# EAGLE design LDAQ-MOD-ENC4 (EAGLE 6.6.0)
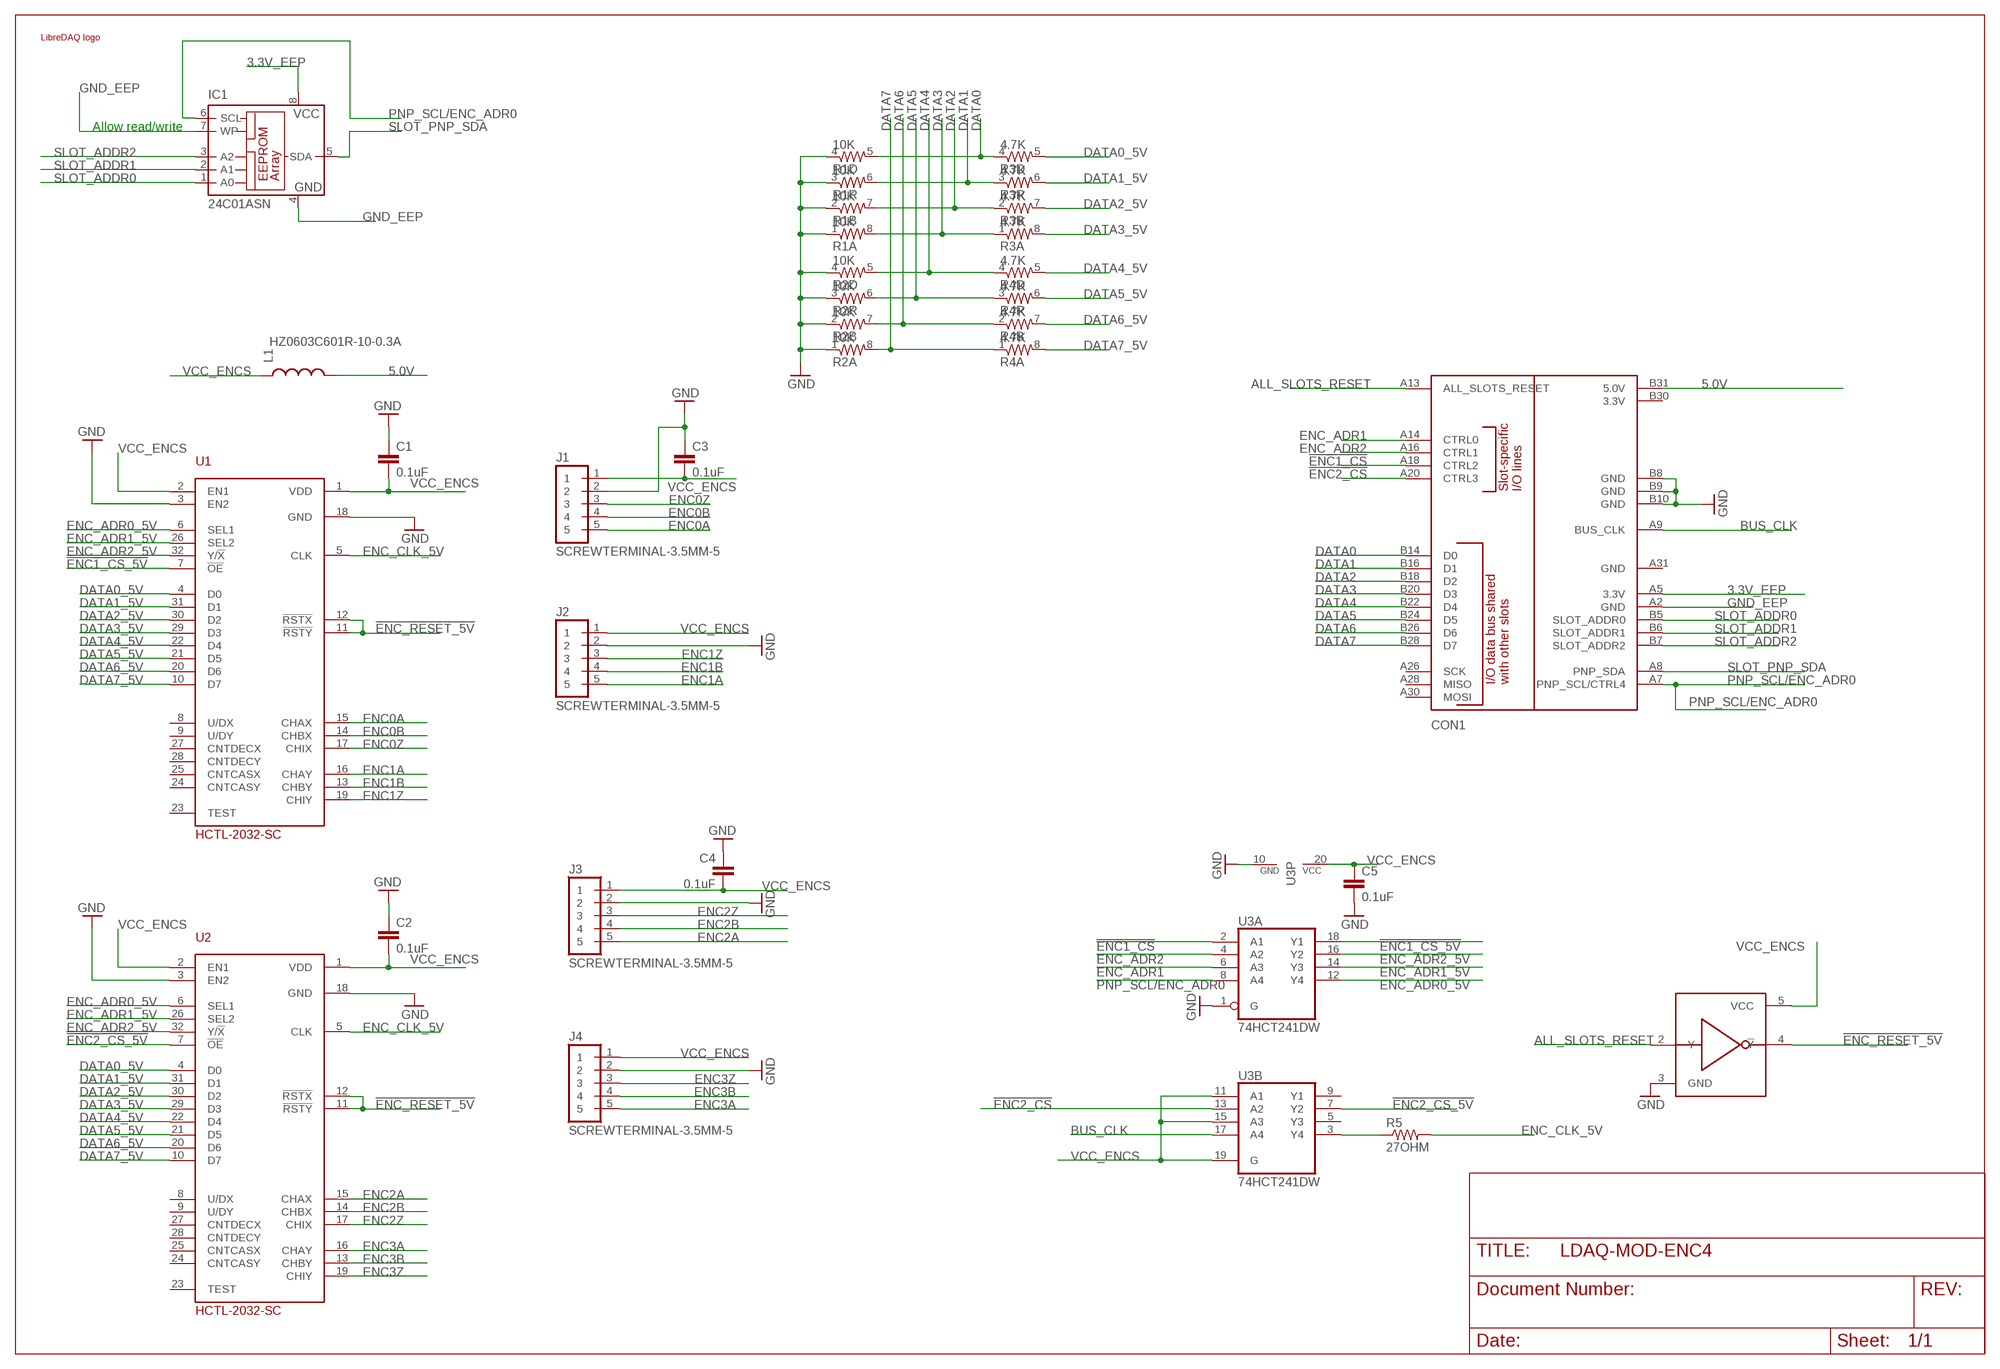
[diagram p0: schematic, sheet 1]

## Parts
C1  0.1uF  0.1UF-25V(+80/-20%)(0603)  [0603-CAP]
C2  0.1uF  0.1UF-25V(+80/-20%)(0603)  [0603-CAP]
C3  0.1uF  0.1UF-25V(+80/-20%)(0603)  [0603-CAP]
C4  0.1uF  0.1UF-25V(+80/-20%)(0603)  [0603-CAP]
C5  0.1uF  0.1UF-25V(+80/-20%)(0603)  [0603-CAP]
CON1  BOARD  LIBREDAQ_DAUGHTER_BOARDPCI-64-SIZE1-PADS  [PCI-E_64_EDGE_70X60_PADS-ONLY]
IC1  24C01ASN  [SO-08]
J1  SCREWTERMINAL-3.5MM-5  [SCREWTERMINAL-3.5MM-5]
J2  SCREWTERMINAL-3.5MM-5  [SCREWTERMINAL-3.5MM-5]
J3  SCREWTERMINAL-3.5MM-5  [SCREWTERMINAL-3.5MM-5]
J4  SCREWTERMINAL-3.5MM-5  [SCREWTERMINAL-3.5MM-5]
L1  HZ0603C601R-10-0.3A  INDUCTOR0603  [0603]
LOGO1  LIBREDAQ_LOGO_MINILOGO_GENERIC  [LIBREDAQ_LOGO]
R1  10K  RESISTOR-ARRAY0603-ARV  [0603-ARV]
R2  10K  RESISTOR-ARRAY0603-ARV  [0603-ARV]
R3  4.7K  RESISTOR-ARRAY0603-ARV  [0603-ARV]
R4  4.7K  RESISTOR-ARRAY0603-ARV  [0603-ARV]
R5  27OHM  33OHM1/10W1%(0603)  [0603]
U1  HCTL-2032-SC  [SOIC32]
U2  HCTL-2032-SC  [SOIC32]
U3  74HCT241DW  [SO20W]
U4  74AHCT1G04  [SOT353-SC70-5]

## Nets
3.3V_EEP: CON1.A5(3.3V) IC1.8(VCC)
5.0V: CON1.B31(5.0V) L1.2
!ENC1_CS: CON1.A18(CTRL2) U3.2(A:A1)
!ENC1_CS_5V: U1.7(!OE) U3.18(A:Y1)
!ENC2_CS: CON1.A20(CTRL3) U3.13(B:A2)
!ENC2_CS_5V: U2.7(!OE) U3.7(B:Y2)
!ENC_RESET_5V: U1.11(!RSTY) U1.12(!RSTX) U2.11(!RSTY) U2.12(!RSTX) U4.4(!Y)
ALL_SLOTS_RESET: CON1.A13(ALL_SLOTS_RESET) U4.2(Y)
BUS_CLK: CON1.A9(BUS_CLK) U3.17(B:A4)
DATA0: CON1.B14(D0) R1.5 R3.4
DATA0_5V: R3.5 U1.4(D0) U2.4(D0)
DATA1: CON1.B16(D1) R1.6 R3.3
DATA1_5V: R3.6 U1.31(D1) U2.31(D1)
DATA2: CON1.B18(D2) R1.7 R3.2
DATA2_5V: R3.7 U1.30(D2) U2.30(D2)
DATA3: CON1.B20(D3) R1.8 R3.1
DATA3_5V: R3.8 U1.29(D3) U2.29(D3)
DATA4: CON1.B22(D4) R2.5 R4.4
DATA4_5V: R4.5 U1.22(D4) U2.22(D4)
DATA5: CON1.B24(D5) R2.6 R4.3
DATA5_5V: R4.6 U1.21(D5) U2.21(D5)
DATA6: CON1.B26(D6) R2.7 R4.2
DATA6_5V: R4.7 U1.20(D6) U2.20(D6)
DATA7: CON1.B28(D7) R2.8 R4.1
DATA7_5V: R4.8 U1.10(D7) U2.10(D7)
ENC0A: J1.5 U1.15(CHAX)
ENC0B: J1.4 U1.14(CHBX)
ENC0Z: J1.3 U1.17(CHIX)
ENC1A: J2.5 U1.16(CHAY)
ENC1B: J2.4 U1.13(CHBY)
ENC1Z: J2.3 U1.19(CHIY)
ENC2A: J3.5 U2.15(CHAX)
ENC2B: J3.4 U2.14(CHBX)
ENC2Z: J3.3 U2.17(CHIX)
ENC3A: J4.5 U2.16(CHAY)
ENC3B: J4.4 U2.13(CHBY)
ENC3Z: J4.3 U2.19(CHIY)
ENC_ADR0_5V: U1.6(SEL1) U2.6(SEL1) U3.12(A:Y4)
ENC_ADR1: CON1.A14(CTRL0) U3.6(A:A3)
ENC_ADR1_5V: U1.26(SEL2) U2.26(SEL2) U3.14(A:Y3)
ENC_ADR2: CON1.A16(CTRL1) U3.4(A:A2)
ENC_ADR2_5V: U1.32(Y/!X) U2.32(Y/!X) U3.16(A:Y2)
ENC_CLK_5V: R5.2 U1.5(CLK) U2.5(CLK)
GND: C1.1 C2.1 C3.1 C4.1 C5.2 CON1.B8(GND) CON1.B9(GND) CON1.B10(GND) J1.2 J2.2 J3.2 J4.2 R1.1 R1.2 R1.3 R1.4 R2.1 R2.2 R2.3 R2.4 U1.3(EN2) U1.18(GND) U2.3(EN2) U2.18(GND) U3.1(A:G) U3.10(P:GND) U4.3(GND)
GND_EEP: CON1.A2(GND) IC1.4(GND) IC1.7(WP)
N$1: R5.1 U3.3(B:Y4)
PNP_SCL/ENC_ADR0: CON1.A7(PNP_SCL/CTRL4) IC1.6(SCL) U3.8(A:A4)
SLOT_ADDR0: CON1.B5(SLOT_ADDR0) IC1.1(A0)
SLOT_ADDR1: CON1.B6(SLOT_ADDR1) IC1.2(A1)
SLOT_ADDR2: CON1.B7(SLOT_ADDR2) IC1.3(A2)
SLOT_PNP_SDA: CON1.A8(PNP_SDA) IC1.5(SDA)
VCC_ENCS: C1.2 C2.2 C3.2 C4.2 C5.1 J1.1 J2.1 J3.1 J4.1 L1.1 U1.1(VDD) U1.2(EN1) U2.1(VDD) U2.2(EN1) U3.11(B:A1) U3.15(B:A3) U3.19(B:G) U3.20(P:VCC) U4.5(VCC)
Unconnected: CON1.A26(SCK) CON1.A28(MISO) CON1.A30(MOSI) CON1.A31(GND) CON1.B30(3.3V) U1.8(U/DX) U1.9(U/DY) U1.23(TEST) U1.24(CNTCASY) U1.25(CNTCASX) U1.27(CNTDECX) U1.28(CNTDECY) U2.8(U/DX) U2.9(U/DY) U2.23(TEST) U2.24(CNTCASY) U2.25(CNTCASX) U2.27(CNTDECX) U2.28(CNTDECY) U3.5(B:Y3) U3.9(B:Y1)

## Notes on the sheet
- Allow read/write

## Library data of the parts
C1-C5 = SparkFun-Capacitors:0.1UF-25V(+80/-20%)(0603): CAP-00810 Ceramic Standard decoupling cap; PROD_ID: CAP-00810
CON1 = libredaq-comps:LIBREDAQ_DAUGHTER_BOARD: LibreDAQ Expansion board (PCI-E form)
IC1 = libredaq-comps:24C*: Serial EEPROM 1 K/2 K/4 K; MPN: AT24C01BN-SH-B; OC_FARNELL: 1362638; OC_NEWARK: 50M3313
J1-J4 = libredaq-comps:SCREWTERMINAL-3.5MM-5
L1 = SparkFun-Passives:INDUCTOR: Inductors Basic Inductor/Choke - 0603 and 1206. Footprints are not proven and vary greatly between part numbers. SRN6045- 33uH, 20% 1.4A SDR0403-560KL - 56uH, 10%, 500mA RMS/740mA peak
LOGO1 = libredaq-comps:LIBREDAQ_LOGO_MINI
R1-R4 = SparkFun-Resistors:RESISTOR-ARRAY: Array Chip Resistor Source: RS Component / Phycomp
R5 = SparkFun-Resistors:33OHM1/10W1%(0603): RES-08270; PROD_ID: RES-08270; VALUE: 33OHM
U1 U2 = libredaq-comps:HCTL-2032-SC: The HCTL-20XX-XX is CMOS ICs that perform the quadrature decoder, counter, and bus interface function.
U3 = libredaq-comps:74*241: Octal BUFFER and LINE DRIVER, 3-state
U4 = libredaq-comps:74AHCT1G04: 74AHCT1G04SE: 1 gate inverter

## Board
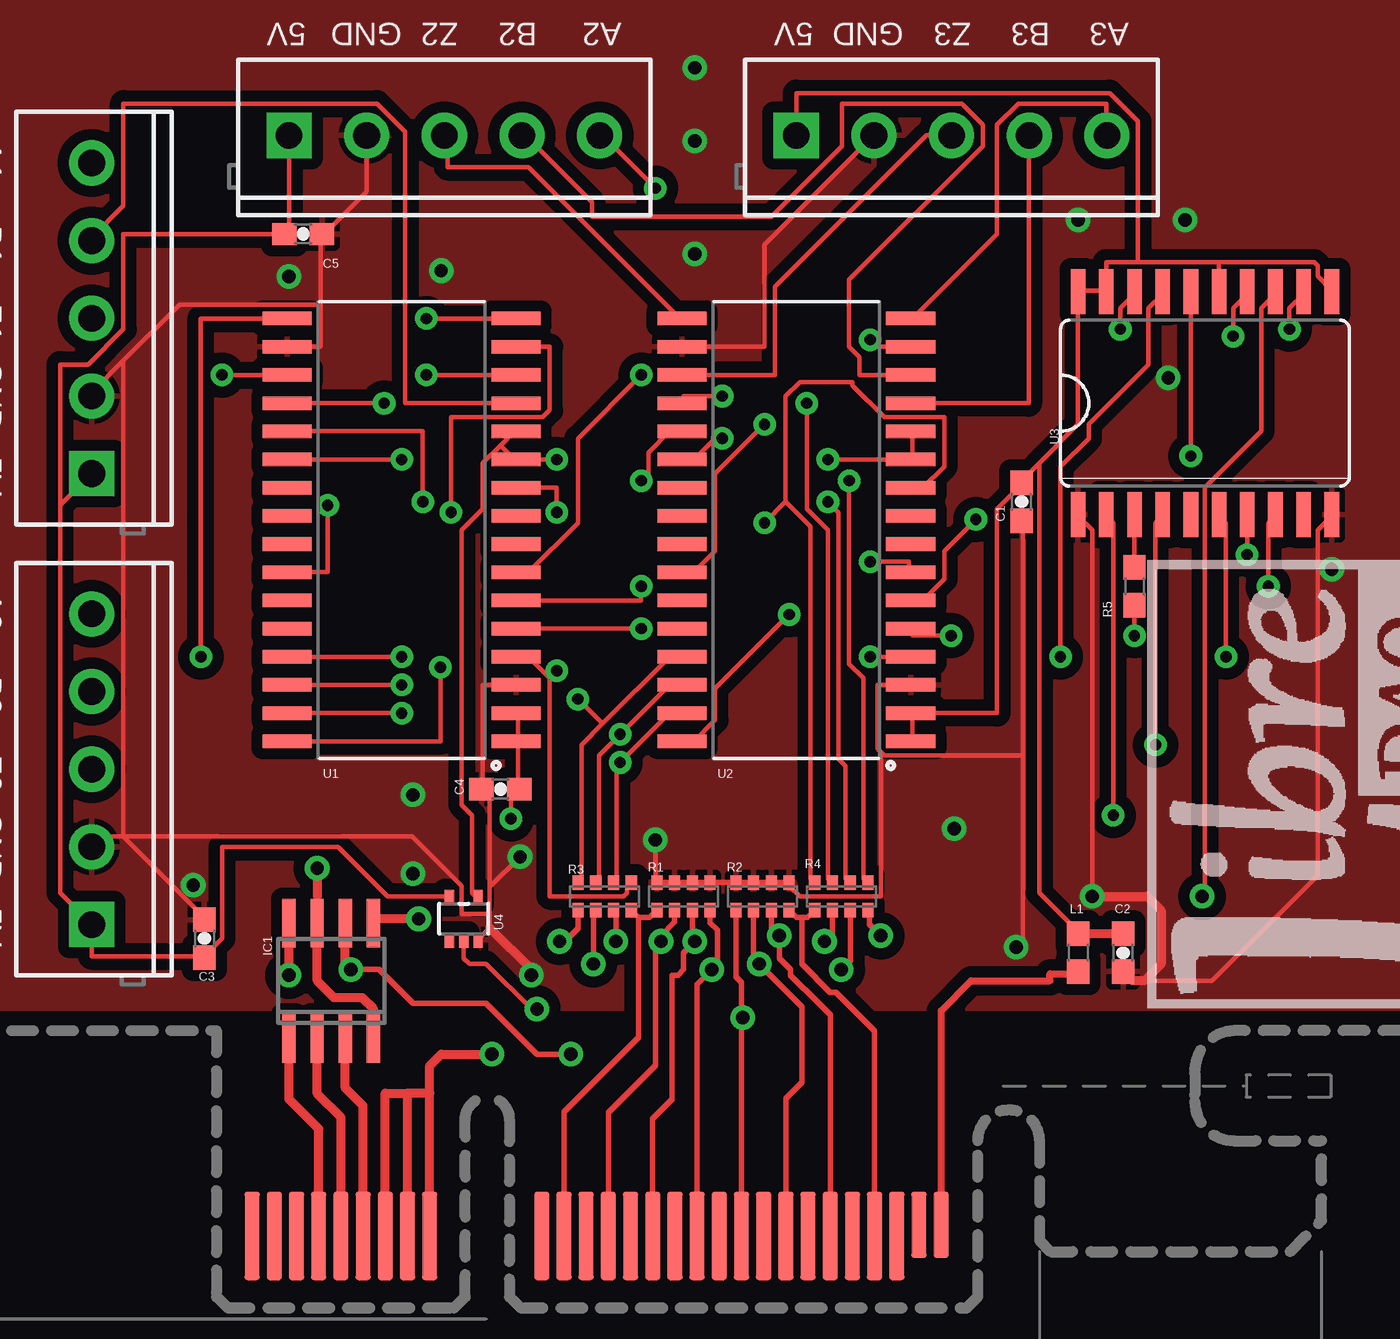
[diagram p1: board, top side]
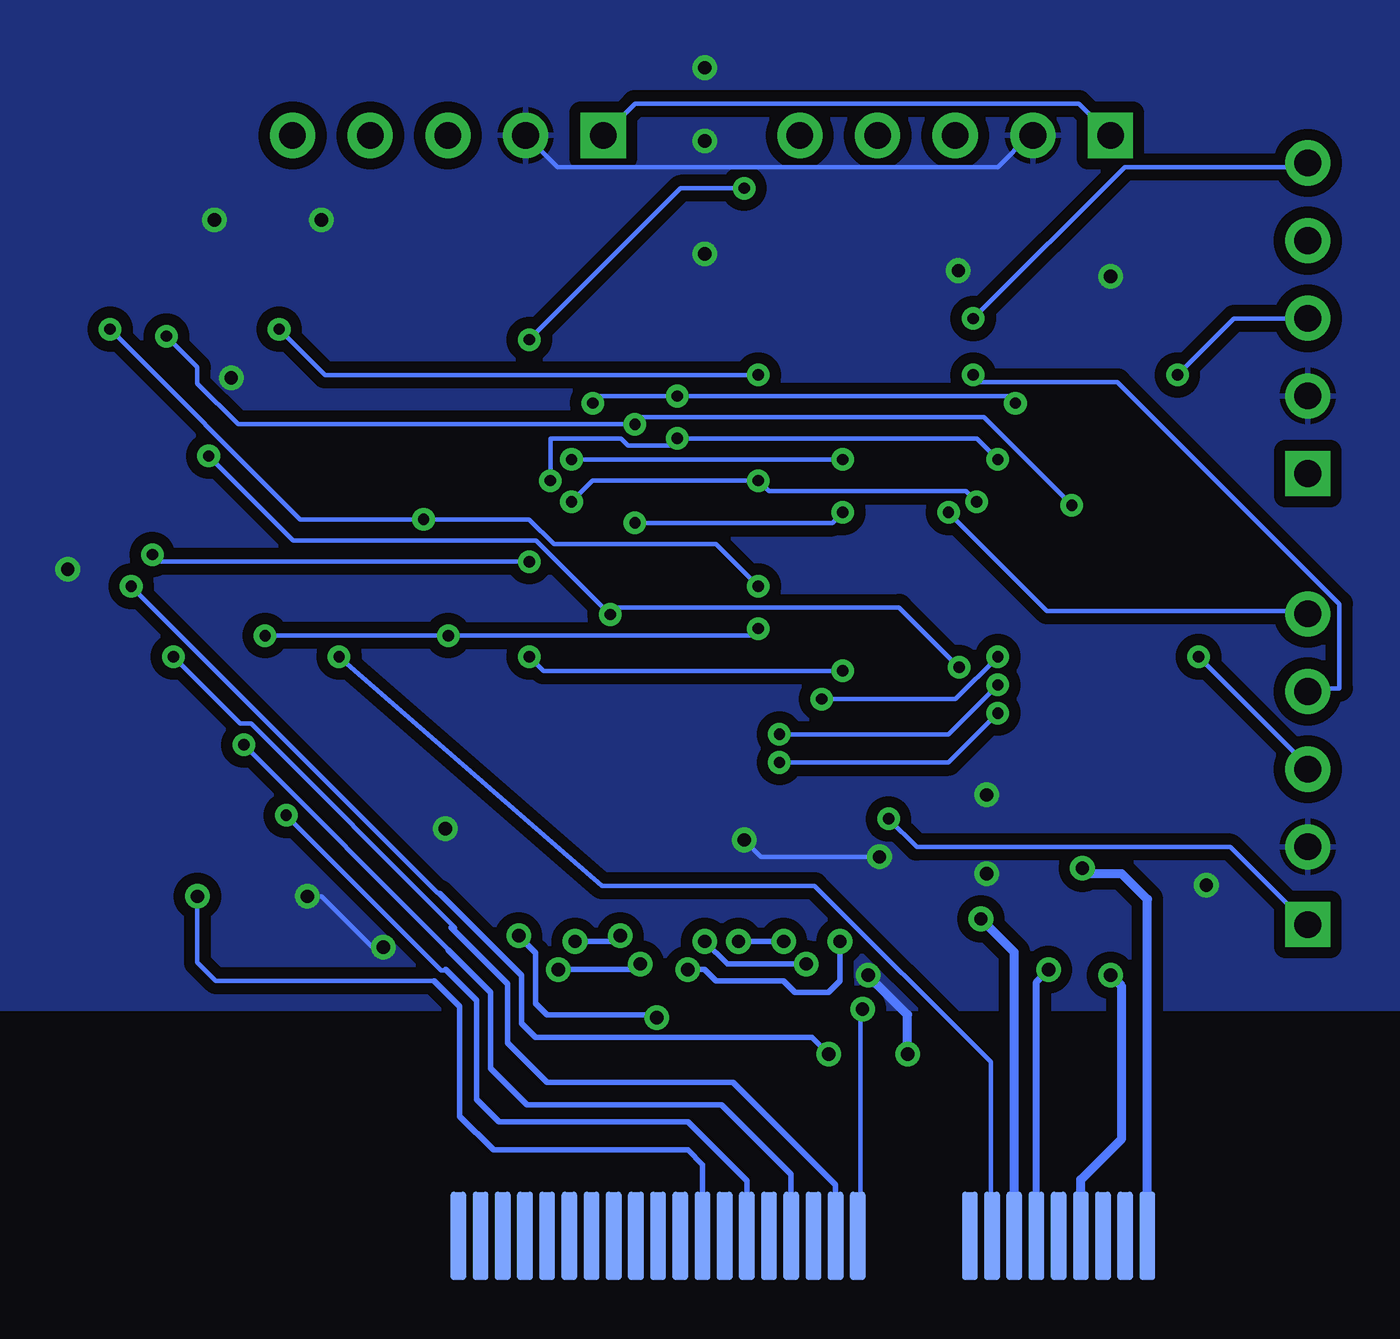
[diagram p2: board, bottom side, seen from below]

No outline drawn. Coordinates in mm, seen from the top.
Copper layers (1*16): Top 0.035mm / dielectric 1.5mm / Bottom 0.035mm
Design rules "LibreDAQ": minimum track width 8mil, minimum drill 20mil, track to track 8mil, track to pad 7mil, pad to pad 7mil, via to via 8mil, smd to smd 7mil, copper to edge 6mil, drill to drill 8mil, minimum pad ring 12mil, minimum via ring 10mil, stop-mask expansion 4mil, vias tented up to drill 25mil, thermal gap 10mil

### Footprints (pad centres in the part's own frame; a part is rotated, then mirrored left to right if it is on the bottom)
0603-CAP = smd 1.1 x 1: 1 -0.85,0; 2 0.85,0
PCI-E_64_EDGE_70X60_PADS-ONLY = smd 0.7 x 4 bottom: A2 -10.55,3.75; A3 -9.55,3.75; A4 -8.55,3.75; A5 -7.55,3.75; A6 -6.55,3.75; A7 -5.55,3.75; A8 -4.55,3.75; A9 -3.55,3.75; A10 -2.55,3.75; A13 2.5,3.75; A14 3.5,3.75; A15 4.5,3.75; A16 5.5,3.75; A17 6.5,3.75; A18 7.5,3.75; A19 8.5,3.75; A20 9.5,3.75; A21 10.5,3.75; A22 11.5,3.75; A23 12.5,3.75; A24 13.5,3.75; A25 14.5,3.75; A26 15.5,3.75; A27 16.5,3.75; A28 17.5,3.75; A29 18.5,3.75; A30 19.5,3.75; A31 20.5,3.75 | smd 0.7 x 4: B2 -10.55,3.75; B3 -9.55,3.75; B4 -8.55,3.75; B5 -7.55,3.75; B6 -6.55,3.75; B7 -5.55,3.75; B8 -4.55,3.75; B9 -3.55,3.75; B10 -2.55,3.75; B13 2.5,3.75; B14 3.5,3.75; B15 4.5,3.75; B16 5.5,3.75; B17 6.5,3.75; B18 7.5,3.75; B19 8.5,3.75; B20 9.5,3.75; B21 10.5,3.75; B22 11.5,3.75; B23 12.5,3.75; B24 13.5,3.75; B25 14.5,3.75; B26 15.5,3.75; B27 16.5,3.75; B28 17.5,3.75; B29 18.5,3.75 | smd 0.7 x 3: B30 19.5,4.25; B31 20.5,4.25
SO-08 = smd 0.6 x 2.2: 1 -1.905,-2.6; 2 -0.635,-2.6; 3 0.635,-2.6; 4 1.905,-2.6; 5 1.905,2.6; 6 0.635,2.6; 7 -0.635,2.6; 8 -1.905,2.6
SCREWTERMINAL-3.5MM-5 = drill 1.2 pad 2.032 square: 1 0,0 | drill 1.2 pad 2.032: 2 3.5,0; 3 7,0; 4 10.5,0; 5 14,0
0603 = smd 1.1 x 1: 1 -0.85,0; 2 0.85,0
0603-ARV = smd 0.5 x 0.65: 1 -1.2,-0.625; 2 -0.4,-0.625; 3 0.4,-0.625; 4 1.2,-0.625; 5 1.2,0.625; 6 0.4,0.625; 7 -0.4,0.625; 8 -1.2,0.625
SOIC32 = smd 0.61 x 2.21: 1 -1.905,-5.156; 2 -0.635,-5.156; 3 0.635,-5.156; 4 1.905,-5.156; 5 3.175,-5.156; 6 4.445,-5.156; 7 5.715,-5.156; 8 6.985,-5.156; 9 8.255,-5.156; 10 9.525,-5.156; 11 10.795,-5.156; 12 12.065,-5.156; 13 13.335,-5.156; 14 14.605,-5.156; 15 15.875,-5.156; 16 17.145,-5.156; 17 17.145,5.156; 18 15.875,5.156; 19 14.605,5.156; 20 13.335,5.156; 21 12.065,5.156; 22 10.795,5.156; 23 9.525,5.156; 24 8.255,5.156; 25 6.985,5.156; 26 5.715,5.156; 27 4.445,5.156; 28 3.175,5.156; 29 1.905,5.156; 30 0.635,5.156; 31 -0.635,5.156; 32 -1.905,5.156
SO20W = smd 0.66 x 2.032: 1 -5.715,-5.029; 2 -4.445,-5.029; 3 -3.175,-5.029; 4 -1.905,-5.029; 5 -0.635,-5.029; 6 0.635,-5.029; 7 1.905,-5.029; 8 3.175,-5.029; 9 4.445,-5.029; 10 5.715,-5.029; 11 5.715,5.029; 12 4.445,5.029; 13 3.175,5.029; 14 1.905,5.029; 15 0.635,5.029; 16 -0.635,5.029; 17 -1.905,5.029; 18 -3.175,5.029; 19 -4.445,5.029; 20 -5.715,5.029
SOT353-SC70-5 = smd 0.42 x 0.7: 1 -0.65,-0.95; 2 0,-0.95; 3 0.65,-0.95; 4 0.65,0.95; 5 -0.65,0.95

### Placement (x,y rotation side)
C1  49.53,36.83 90 top
C2  54.1,16.51 90 top
C3  12.7,17.14 270 top
C4  26.04,23.88 0 top
C5  17.14,48.9 0 top
CON1  25.4,0 0 top
IC1  18.41,15.24 0 top
J1  7.62,17.78 90 top
J2  7.62,38.1 90 top
J3  16.51,53.34 0 top
J4  39.37,53.34 0 top
L1  52.07,16.51 270 top
LOGO1  70.1,13.97 90 top
R1  34.29,19.05 180 top
R2  37.85,19.05 180 top
R3  30.73,19.05 0 top
R4  41.4,19.05 0 top
R5  54.61,33.02 270 top
U1  21.59,27.94 90 top
U2  39.37,27.94 90 top
U3  57.78,41.27 0 top
U4  24.38,18.03 0 top

### Tracks (layer width: path | path; a pad name or v marks a point on that pad's centre or on a via)
3.3V_EEP  (via drill 0.6)
  Top 0.406: v16.51,15.49 IC1.8
  Bottom 0.406: CON1.A5 17.85,6.28 16,8.13 16,14.99 v16.51,15.49
5.0V
  Top 0.203: 52.07,15.56 L1.2
  Top 0.305: 52.07,15.56 50.8,15.56 50.8,15.24 47.24,15.24 45.9,13.9 CON1.B31
!ENC1_CS  (via drill 0.51)
  Top 0.203: v53.66,22.7 53.66,35.88 53.34,36.2 U3.2
  Bottom 0.203: v53.66,22.7 46.67,15.72 46.51,15.72 46.48,15.75
  Bottom 0.254: 46.48,15.75 45.09,14.35 45.09,9.91 44.07,8.89 35.56,8.89 32.9,6.23 CON1.A18
!ENC1_CS_5V  (via drill 0.51)
  Top 0.203: v53.98,44.61 53.98,45.56 54.61,46.2 U3.18 | v32.38,42.55 29.53,39.69 29.53,35.88 27.3,33.66 U1.7
  Bottom 0.203: v53.98,44.61 51.91,42.55 v32.38,42.55
!ENC2_CS  (via drill 0.6)
  Top 0.203: U3.13 60.96,46.2 60.33,45.56 60.33,40.01 57.78,37.47 57.78,19.18 v57.66,19.05
  Bottom 0.203: 46.99,15.24 56.83,15.24 57.66,16.07 v57.66,19.05
  Bottom 0.254: 46.99,15.24 45.85,14.1 45.85,9.14 44.32,7.62 35.56,7.62 34.9,6.96 CON1.A20
!ENC2_CS_5V  (via drill 0.51)
  Top 0.203: v59.69,34.45 U3.7 | v42.7,34.13 44.45,34.13 44.45,33.66 U2.7
  Bottom 0.203: v59.69,34.45 59.37,34.13 v42.7,34.13
!ENC_RESET_5V  (via drill 0.51)
  Top 0.203: U2.12 44.61,40.01 44.61,38.73 U2.11 v40.8,38.73 | 26.04,39.37 26.67,40.01 U1.12 | 26.04,39.37 25.24,38.58 25.24,36.51 24.29,35.56 24.29,23.18 24.77,22.7 24.77,19.21 24.92,19.05 U4.4 | 26.04,39.37 26.67,38.73 U1.11 v28.57,38.73
  Bottom 0.203: v28.57,38.73 v40.8,38.73
ALL_SLOTS_RESET  (via drill 0.6)
  Top 0.203: v27.69,13.97 27.43,13.97 25.4,16 24.64,16 24.38,16.26 U4.2
  Bottom 0.203: CON1.A13 27.78,3.81 27.78,13.88 v27.69,13.97
BUS_CLK  (via drill 0.51)
  Top 0.203: v51.28,29.84 51.28,38.42 52.55,39.69 52.55,40.32 55.24,43.02 55.24,45.56 55.88,46.2 U3.17
  Bottom 0.203: v51.28,29.84 39.43,19.53 29.84,19.53 21.91,11.59 21.91,3.81 CON1.A9
DATA0
  Top 0.254: 32.26,18.1 32.26,12.7 28.9,9.34 CON1.B14 | 32.26,18.1 R3.4 | 32.26,18.1 32.77,18.1 R1.5
DATA0_5V  (via drill 0.51)
  Top 0.203: 28.26,28.89 28.26,19.05 31.59,19.05 31.75,19.21 31.75,19.37 31.91,19.53 R3.5 | 28.26,28.89 27.3,29.84 U1.4 | v42.7,29.84 U2.4 | 28.26,28.89 v28.57,29.21
  Bottom 0.203: v42.7,29.84 42.07,29.21 v28.57,29.21
DATA1  (via drill 0.6)
  Top 0.254: v31.24,17.02 31.24,18.32 R3.3 | 33.78,18.32 R1.6 33.89,17.89 33.27,17.27 v33.27,17.02 33.02,16.51 33.02,11.43 30.9,9.31 CON1.B16
  Bottom 0.254: v33.27,17.02 v31.24,17.02
DATA1_5V  (via drill 0.51)
  Top 0.203: U2.31 33.66,27.3 v31.43,25.08 31.27,24.92 31.27,19.68 R3.6 | v21.59,27.3 U1.31
  Bottom 0.203: v21.59,27.3 23.81,25.08 v31.43,25.08
DATA2  (via drill 0.6)
  Top 0.254: v30.23,16 30.23,18.32 R3.2 | R1.7 34.69,17.13 v34.8,17.02 34.29,16.51 34.29,15.75 34.04,15.49 33.78,15.49 33.78,9.91 32.9,9.02 CON1.B18
  Bottom 0.254: v30.23,16 33.78,16 v34.8,17.02
DATA2_5V  (via drill 0.51)
  Top 0.203: U2.30 33.66,28.57 v31.43,26.35 30.48,25.4 30.48,19.68 R3.7 | v21.59,28.57 U1.30
  Bottom 0.203: v21.59,28.57 23.81,26.35 v31.43,26.35
DATA3  (via drill 0.6)
  Top 0.254: R1.8 35.49,17.85 35.81,17.53 35.81,16 v35.56,15.75 34.9,15.09 CON1.B20 | v28.7,17.02 28.96,17.02 29.53,17.6 R3.1
  Bottom 0.254: v35.56,15.75 34.8,15.75 34.29,15.24 31.24,15.24 30.73,14.73 29.21,14.73 28.7,15.24 v28.7,17.02
DATA3_5V  (via drill 0.51)
  Top 0.203: 30.64,26.83 33.66,29.84 U2.29 | 30.64,26.83 29.69,25.88 29.69,19.68 R3.8 | v21.59,29.84 U1.29 | 30.64,26.83 v29.53,27.94
  Bottom 0.203: v21.59,29.84 23.5,27.94 v29.53,27.94
DATA4  (via drill 0.6)
  Top 0.254: v43.18,17.27 42.67,17.78 42.67,18.36 R4.4 | R2.5 36.65,15.42 36.9,15.17 36.9,13.65 v36.96,13.59 36.9,13.53 CON1.B22
  Bottom 0.254: v43.18,17.27 42.42,16.51 42.42,14.22 41.91,13.72 37.08,13.72 v36.96,13.59
DATA4_5V  (via drill 0.51)
  Top 0.203: v41.75,37.78 41.75,29.53 42.39,28.89 42.39,19.84 42.55,19.68 R4.5 | v36.04,39.69 35.72,39.69 34.77,38.73 U2.22 | v21.59,38.73 U1.22
  Bottom 0.203: v41.75,37.78 41.75,39.69 38.58,39.69 38.26,39.37 36.35,39.37 v36.04,39.69 22.54,39.69 v21.59,38.73
DATA5  (via drill 0.6)
  Top 0.254: R4.3 41.8,16.15 v41.4,15.75 | R2.6 37.45,16.26 v37.7,16 39.62,14.08 39.62,10.67 38.9,9.94 CON1.B24
  Bottom 0.254: v41.4,15.75 37.95,15.75 v37.7,16
DATA5_5V  (via drill 0.51)
  Top 0.203: v40.8,36.83 41.27,36.35 41.27,25.24 41.59,24.92 41.59,19.84 41.75,19.68 R4.6 | v32.38,37.78 32.7,38.1 32.7,39.05 33.66,40.01 U2.21 | U1.21 22.54,40.01 v22.54,36.83
  Bottom 0.203: v40.8,36.83 39.85,37.78 v32.38,37.78 31.91,37.31 23.02,37.31 v22.54,36.83
DATA6  (via drill 0.6)
  Top 0.254: R4.2 41,17.38 v40.64,17.02 | v38.61,17.27 38.35,17.53 | R2.7 38.25,17.63 v38.61,17.27 | v38.61,17.27 38.61,16.26 39.12,15.75 39.12,15.49 40.36,14.25 40.9,13.71 CON1.B26
  Bottom 0.254: v40.64,17.02 38.86,17.02 v38.61,17.27
DATA6_5V  (via drill 0.51)
  Top 0.203: v39.85,41.27 39.85,36.51 40.8,35.56 40.8,19.84 40.96,19.68 R4.7 | v36.04,41.59 34.29,41.59 34.29,41.27 U2.20 | v20.8,41.27 U1.20
  Bottom 0.203: v39.85,41.27 39.53,41.59 v36.04,41.59 21.11,41.59 v20.8,41.27
DATA7
  Top 0.254: R2.8 39.37,18.1 39.62,18.1 | 39.62,18.1 39.88,18.1 R4.1 | 39.62,18.1 39.62,16 40.89,14.73 41.15,14.73 42.63,13.25 42.9,12.98 CON1.B28
DATA7_5V  (via drill 0.51)
  Top 0.203: 38.89,36.83 40.01,35.72 40.01,19.84 40.16,19.68 R4.8 | 38.89,36.83 38.89,41.59 39.53,42.23 41.91,42.23 41.91,42.07 43.34,40.64 46.04,40.64 46.04,38.42 45.09,37.47 U2.10 | U1.10 28.57,37.47 v28.57,36.35 | 38.89,36.83 v37.94,35.88
  Bottom 0.203: v28.57,36.35 29.05,35.88 v37.94,35.88
ENC0A  (via drill 0.51)
  Top 0.203: U1.15 28.26,43.81 28.26,40.96 27.94,40.64 23.81,40.64 v23.81,36.35
  Bottom 0.203: v23.81,36.35 19.37,31.91 7.62,31.91 J1.5
ENC0B  (via drill 0.51)
  Top 0.203: v22.7,42.55 U1.14
  Bottom 0.203: v22.7,42.55 22.38,42.23 16.19,42.23 6.19,32.23 6.19,28.42 7.62,28.42 J1.4
ENC0Z  (via drill 0.51)
  Top 0.203: U1.17 12.54,45.09 v12.54,29.84
  Bottom 0.203: v12.54,29.84 7.62,24.92 J1.3
ENC1A  (via drill 0.51)
  Top 0.203: v22.7,45.09 U1.16
  Bottom 0.203: v22.7,45.09 15.88,51.91 7.78,51.91 7.62,52.07 J2.5
ENC1B
  Top 0.203: U1.13 21.75,41.27 21.75,53.5 20.48,54.77 9.05,54.77 9.05,50.16 7.62,48.74 J2.4
ENC1Z  (via drill 0.51)
  Top 0.203: v13.49,42.55 U1.19
  Bottom 0.203: v13.49,42.55 10.95,45.09 7.62,45.09 J2.3
ENC2A  (via drill 0.51)
  Top 0.203: U2.15 42.7,43.81 v42.7,44.13 | v33.02,50.96 30.64,53.34 J3.5
  Bottom 0.203: v42.7,44.13 35.88,50.96 v33.02,50.96
ENC2B
  Top 0.203: U2.14 42.23,42.55 42.23,43.34 41.75,43.81 41.75,46.83 47.78,52.86 47.78,53.82 46.83,54.77 41.43,54.77 41.43,52.86 38.26,49.69 30.16,49.69 30.16,50.32 27.15,53.34 J3.4
ENC2Z
  Top 0.203: U2.17 34.13,45.09 27.3,51.91 23.65,51.91 23.65,53.34 J3.3
ENC3A
  Top 0.203: U2.16 44.61,45.09 48.42,48.9 48.42,53.82 49.37,54.77 53.34,54.77 53.34,53.34 J4.5
ENC3B
  Top 0.203: U2.13 49.85,41.27 49.85,53.34 J4.4
ENC3Z
  Top 0.203: U2.19 38.42,42.55 38.42,46.51 45.24,53.34 J4.3
ENC_ADR0_5V  (via drill 0.51)
  Top 0.203: v61.59,44.61 61.59,45.56 62.23,46.2 U3.12 | v47.47,36.04 46.04,34.61 46.04,33.34 45.09,32.38 U2.6 | U1.6 32.38,32.38 v32.38,33.02
  Bottom 0.203: v61.59,44.61 53.02,36.04 v47.47,36.04 42.7,36.04 41.59,34.92 34.29,34.92 v32.38,33.02
ENC_ADR1  (via drill 0.51)
  Top 0.203: v58.74,29.84 58.74,35.88 58.42,36.2 U3.6
  Bottom 0.203: v58.74,29.84 55.72,26.83 55.24,26.83 46.04,17.62 46.12,17.54
  Bottom 0.254: 46.23,17.65 46.12,17.54 43.69,15.11 43.69,12.45 41.91,10.67 33.53,10.67 28.9,6.04 CON1.A14
ENC_ADR1_5V  (via drill 0.51)
  Top 0.203: v59.05,44.29 59.05,45.56 59.69,46.2 U3.14 | v37.94,40.32 35.72,38.1 35.72,34.61 34.77,33.66 U2.26 | U1.26 18.26,33.66 v18.26,36.67
  Bottom 0.203: v18.26,36.67 22.23,40.64 37.62,40.64 v37.94,40.32 55.82,40.32 57.66,42.16 57.66,42.89 v59.05,44.29
ENC_ADR2  (via drill 0.51)
  Top 0.203: v55.56,25.88 55.56,35.88 55.88,36.2 U3.4
  Bottom 0.203: v55.56,25.88 46.35,16.67 46.35,16.64
  Bottom 0.254: 46.35,16.64 44.45,14.73 44.45,11.3 42.8,9.65 34.04,9.65 30.9,6.52 CON1.A16
ENC_ADR2_5V  (via drill 0.51)
  Top 0.203: v57.15,38.89 U3.16 | v39.05,31.75 35.72,28.42 35.72,26.99 34.77,26.04 U2.32 | U1.32 23.34,26.04 v23.34,29.37
  Bottom 0.203: v57.15,38.89 53.34,35.08 42.39,35.08 39.37,32.07 | v23.34,29.37 26.04,32.07 39.37,32.07 | 39.37,32.07 v39.05,31.75
ENC_CLK_5V  (via drill 0.51)
  Top 0.203: v54.61,30.8 R5.2 | v46.35,30.8 44.61,30.8 44.61,31.11 U2.5 | v32.38,31.11 U1.5
  Bottom 0.203: v54.61,30.8 v46.35,30.8 32.7,30.8 v32.38,31.11
GND  (via drill 0.6)
  Top 0.203: 49.59,25.4 49.59,17.08 v49.28,16.76 | 49.59,25.4 49.59,35.56 49.53,35.88 C1.1 | v52.7,19.05 52.7,35.56 52.07,36.2 U3.1 | 55.05,15.24 58.1,15.24 62.87,20 62.87,35.56 63.5,36.2 U3.10 | U2.3 43.02,28.57 43.02,25.72 43.18,25.56 | 43.18,25.56 43.34,25.4 49.59,25.4 | 43.18,25.56 43.18,19.05 39.53,19.05 39.05,19.53 R2.1 | U2.18 37.94,43.81 37.94,48.42 J4.2 | 25.08,16.99 U4.3 25.08,17.14 25.56,17.62 25.56,18.26 | 25.56,19.46 25.56,23.5 25.24,23.81 C4.1 25.24,23.97 25.24,28.57 U1.3 | 9.05,21.75 12.7,18.1 C3.1 | 9.05,21.75 7.62,21.75 J1.2 | J3.2 20,50.8 18.1,48.9 C5.2 17.94,48.9 17.94,45.72 | U1.18 17.94,43.81 17.94,45.72 | 9.05,43.18 11.59,45.72 17.94,45.72 | 9.05,43.18 7.62,41.75 J2.2 | 9.05,43.18 9.05,21.75 | 25.56,18.26 24.29,18.26 24.29,19.53 22.07,21.75 9.05,21.75 | 25.56,18.26 25.56,19.46 | 25.56,19.46 v26.92,20.83 | v33.02,21.59 33.02,19.75 R1.4 | 54.13,15.24 54.13,15.63 C2.1
  Top 0.254: R1.4 R1.3 R1.2 R1.1 R2.4 R2.3 R2.2 R2.1
  Top 0.406: CON1.B9 21.85,10.18 | CON1.B10 22.85,10.18 | 22.85,10.18 21.85,10.18 | CON1.B8 20.85,10.18 21.85,10.18 | 22.85,10.18 22.85,11.42 23.37,11.94 v25.65,11.94 | v27.43,15.49 27.43,15.75 25.56,17.62 | v52.7,19.05 55.18,19.05 55.82,18.41 55.82,16 55.05,15.24 54.52,15.24 C2.1
  Bottom 0.203: J4.2 41.43,51.91 21.59,51.91 20.16,53.34 J3.2 | v26.92,20.83 32.26,20.83 v33.02,21.59 | v49.28,16.76 49.78,16.76 52.07,19.05 v52.7,19.05
  Bottom 0.406: v25.65,11.94 25.65,13.72 v27.43,15.49
  other vias: 56.13,42.42 34.8,48.01 23.37,47.24 34.8,56.39 34.8,53.09 16.51,46.99 12.19,19.56 22.1,23.62 22.1,20.07 46.48,22.1 63.5,33.78 56.9,49.53 52.07,49.53
  pour Top (isolate 0.508): 0.76,59.69 0.25,13.97 70.1,13.97 69.85,59.69
  pour Bottom (isolate 0.508): 0.76,59.69 0.25,13.97 70.1,13.97 69.85,59.69
GND_EEP  (via drill 0.6)
  Top 0.203: 17.78,19.05 IC1.7
  Top 0.406: IC1.4 20.32,13.97 19.81,14.48 18.54,14.48 17.78,15.24 IC1.7 | v17.78,20.32 17.78,19.05
  Bottom 0.406: CON1.A2 14.85,18.91 16,20.07 17.53,20.07 v17.78,20.32
N$1
  Top 0.203: U3.3 R5.1
PNP_SCL/ENC_ADR0  (via drill 0.51, 0.6)
  Top 0.203: v60.64,33.02 60.64,35.88 60.96,36.2 U3.8
  Top 0.254: v19.3,15.75 20.57,15.75 22.1,14.22 25.4,14.22 27.69,11.94 v29.21,11.94
  Top 0.406: v19.3,15.75 19.05,16 IC1.6
  Bottom 0.203: v60.64,33.02 46.83,19.21 46.74,19.18
  Bottom 0.254: 46.74,19.18 43.05,15.49 43.05,13.34 42.42,12.7 29.97,12.7 v29.21,11.94
  Bottom 0.305: CON1.A7 19.85,15.2 v19.3,15.75
SLOT_ADDR0
  Top 0.406: CON1.B5 17.85,8.57 16.51,9.91 IC1.1
SLOT_ADDR1
  Top 0.406: CON1.B6 18.85,9.09 17.78,10.16 IC1.2
SLOT_ADDR2
  Top 0.406: CON1.B7 19.85,9.61 19.05,10.41 IC1.3
SLOT_PNP_SDA  (via drill 0.6)
  Top 0.406: v22.35,18.03 20.51,18.03 IC1.5
  Bottom 0.406: CON1.A8 20.85,16.53 v22.35,18.03
VCC_ENCS  (via drill 0.51)
  Top 0.203: 58.42,47.62 62.71,47.62 62.87,47.47 62.87,46.99 63.5,46.35 U3.11 | U3.15 58.42,47.62 | 44.61,27.3 44.61,26.04 U2.1 | 50.32,38.58 52.07,40.32 U3.20 52.07,46.35 53.34,46.35 | 50.32,38.58 49.53,37.78 C1.2 49.53,37.62 48.42,36.51 48.42,27.3 44.61,27.3 | 50.32,38.58 50.32,19.21 52.07,17.46 L1.1 | 44.61,27.3 U2.2 | 54.77,47.62 53.34,47.62 53.34,46.35 | 54.77,47.62 58.42,47.62 | 53.34,46.35 U3.19 | J3.1 16.51,49.05 16.35,48.9 C5.1 9.05,48.9 9.05,44.61 7.46,43.02 6.19,43.02 6.19,36.67 | 12.7,16.35 13.49,17.14 13.49,21.27 18.73,21.27 20.95,19.05 23.65,19.05 U4.5 | 26.83,26.04 26.83,23.97 C4.2 26.83,23.81 26.51,23.5 v26.51,22.54 | 26.83,26.04 26.83,27.3 U1.2 | 26.83,26.04 U1.1 | 6.19,36.67 J2.1 | 6.19,36.67 6.19,19.21 J1.1 7.62,16.35 12.7,16.35 | 12.7,16.35 C3.2 | 54.77,47.62 54.77,53.98 53.5,55.24 39.37,55.24 J4.1
  Top 0.406: C2.2 L1.1
  Bottom 0.203: J4.1 37.94,54.77 17.94,54.77 J3.1 | v26.51,22.54 25.24,21.27 11.11,21.27 J1.1

### Text on the board
tPlace: LibreDAQ ENC-4
tNames: 5V | GND | Z2 | B2 | A2 | 5V | GND | Z3 | B3 | A3 | A1 | B1 | Z1 | GND | 5V | A0 | B0 | Z0 | GND | 5V